# Altium schematic sheet 08_MCU_POWER.SchDoc: MCU POWER
size A4; Author: Gabriel; Organization: Altium Limited; Address1: L3, 12a Rodborough Rd; Address2: Frenchs Forest; Address3: NSW; Address4: Australia 2086; Revision: v2.0; SheetNumber: 8; SheetTotal: 8; Subtitle: XDRONE
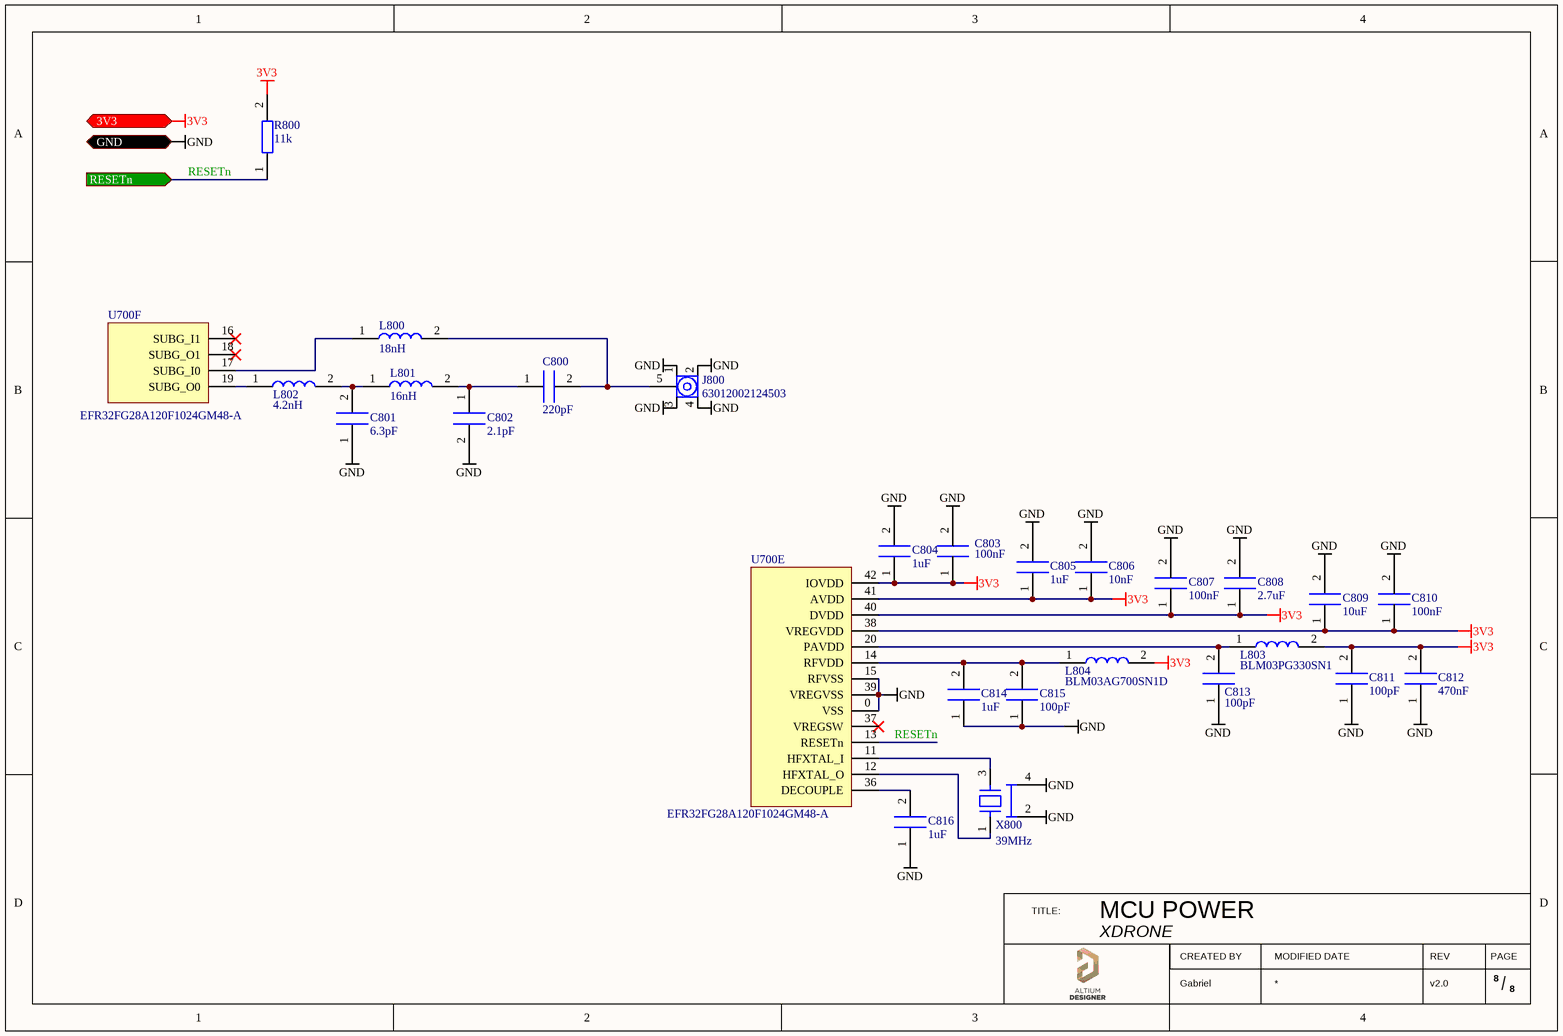
[diagram p0: 08_MCU_POWER.SchDoc]

## Parts
C800  value 220pF  [CAP_0805]  (hidden comment: 220pF_5%_50V_0805_C0G,NP0_QSCT251Q221J1GV001E)
C801  value 6.3pF  [CAP_0402]  (hidden comment: 6.3pF_1.5%_50V_0402_CBR04C639B5GAC)
C802  value 2.1pF  [CAP_0402]  (hidden comment: 2.1pF_5%_50V_0402_GJM1555C1H2R1BB01D)
C803  value 100nF  [CAP_0402]  (hidden comment: 100nF_10%_16V_0402_GRM155R71C104KA88J)
C804  value 1uF  [CAP_0402]  (hidden comment: 1uF_10%_35V_0402_GRM155R6YA105KE11J)
C805  value 1uF  [CAP_0402]  (hidden comment: 1uF_10%_35V_0402_GRM155R6YA105KE11J)
C806  value 10nF  [CAP_0402]  (hidden comment: 10nF_10%_6.3V_0402_CC0402KRX7R5BB103)
C807  value 100nF  [CAP_0402]  (hidden comment: 100nF_10%_16V_0402_GRM155R71C104KA88J)
C808  value 2.7uF  [CAP_0805]  (hidden comment: 2.7uF_10%_10V_0805_X5R_C0805C275K8PAC7800)
C809  value 10uF  [CAP_0402]  (hidden comment: 10uF_20%_6.3V_0402_GRM155R60J106ME05D)
C810  value 100nF  [CAP_0402]  (hidden comment: 100nF_10%_16V_0402_GRM155R71C104KA88J)
C811  value 100pF  [CAP_0402]  (hidden comment: 100pF_5%_50V_0402_CC0402JRNPO9BN101)
C812  value 470nF  [CAP_0402]  (hidden comment: 470nF_10%_6.3V_0402_GRM155C80J474KE19D)
C813  value 100pF  [CAP_0402]  (hidden comment: 100pF_5%_50V_0402_CC0402JRNPO9BN101)
C814  value 1uF  [CAP_0402]  (hidden comment: 1uF_10%_35V_0402_GRM155R6YA105KE11J)
C815  value 100pF  [CAP_0402]  (hidden comment: 100pF_5%_50V_0402_CC0402JRNPO9BN101)
C816  value 1uF  [CAP_0402]  (hidden comment: 1uF_10%_35V_0402_GRM155R6YA105KE11J)
J800  MANUFACTURER REFERENCE: 63012002124503  [RF_63012002124503]  (hidden comment: RF_63012002124503)
L800  value 18nH  [RF_IND_0402]  (hidden comment: 18nH_2%_400mA_LQG15HS18NG02D)
L801  value 16nH  [RF_IND_0402]  (hidden comment: 16nH_3%_400mA_MLG1005S16NHT000)
L802  value 4.2nH  [RF_IND_0402]  (hidden comment: 4.2nH_5%_1.8A_LQW15AN4N2C8ZD)
L803  MANUFACTURER REFERENCE: BLM03PG330SN1  [IND_0201]  (hidden comment: 52nH_25%_750mA_BLM03PG330SN1)
L804  MANUFACTURER REFERENCE: BLM03AG700SN1D  [IND_0201]  (hidden comment: 110nH_50%_200mA_BLM03AG700SN1D)
R800  value 11k  [RES_0402]  (hidden comment: RES_11k_5%_0402_ERJ-2GEJ113X)
U700  MANUFACTURER REFERENCE: EFR32FG28A120F1024GM48-A  [QFN48]  (hidden comment: MCU_1MB_256kB_EFR32FG28A120F1024GM48-A)  (parts E,F of 6)
X800  FREQUENCY: 39MHz  [4-SMD]  (hidden comment: QUARTZ_39MHz_10ppm_ECS-390-10-37B-CKM-TR)

## Ports
3V3 (in), GND (in), RESETn (in)

## Nets
3V3: C803.1 C804.1 C805.1 C806.1 C807.1 C808.1 C809.1 C810.1 C811.2 C812.2 L803.2 L804.2 R800.2 U700.38(VREGVDD) U700.40(DVDD) U700.41(AVDD) U700.42(IOVDD) ; port 3V3
GND: C801.1 C802.2 C803.2 C804.2 C805.2 C806.2 C807.2 C808.2 C809.2 C810.2 C811.1 C812.1 C813.1 C814.1 C815.1 C816.1 J800.1 J800.2 J800.3 J800.4 U700.0(VSS) U700.15(RFVSS) U700.39(VREGVSS) X800.2 X800.4 ; port GND
RESETn: R800.1 U700.13(RESETn) ; port RESETn
NetC800_1: C800.1 C802.1 L801.2
NetC800_2: C800.2 J800.5 L800.2
NetC801_2: C801.2 L801.1 L802.2
NetC813_2: C813.2 L803.1 U700.20(PAVDD)
NetC814_2: C814.2 C815.2 L804.1 U700.14(RFVDD)
NetC816_2: C816.2 U700.36(DECOUPLE)
NetL800_1: L800.1 U700.17(SUBG_I0)
NetL802_1: L802.1 U700.19(SUBG_O0)
NetU700_11: U700.11(HFXTAL_I) X800.3
NetU700_12: U700.12(HFXTAL_O) X800.1

Not connected (* = marked no-connect by the designer): U700 16(SUBG_I1)* 18(SUBG_O1)* 37(VREGSW)*

## Notes on the sheet
- TITLE:
- CREATED BY
- MODIFIED DATE
- REV
- PAGE
- /

## Library data of the parts
C800 = 220pF_5%_50V_0805_C0G,NP0_QSCT251Q221J1GV001E: CAP 220pF 5% 50V 0805 C0G,NP0; MANUFACTURER: JOHANSON TECHLONOGY; DIELECTRIC: C0G, NP0; TOLERANCE: 5%; VOLTAGE RATING: 50V; PACKAGING: 0805; MOUNTING: SMD; MANUFACTURER REFERENCE: QSCT251Q221J1GV001E
C801 = 6.3pF_1.5%_50V_0402_CBR04C639B5GAC: CAPACITOR 6.3pF 1.5% 50V 0402 CBR04C639B5GAC; MANUFACTURER: KEMET; DIELECTRIC: C0G, NP0; TOLERANCE: 1.5%; VOLTAGE RATING: 50V; PACKAGING: 0402; MOUNTING: SMD; MANUFACTURER REFERENCE: CBR04C639B5GAC
C802 = 2.1pF_5%_50V_0402_GJM1555C1H2R1BB01D: CAPACITOR 2.1pF 5% 50V 0402 GJM1555C1H2R1BB01D; MANUFACTURER: MURATA; DIELECTRIC: C0G, NP0; TOLERANCE: 5%; VOLTAGE RATING: 50V; PACKAGING: 0402; MOUNTING: SMD; MANUFACTURER REFERENCE: GJM1555C1H2R1BB01D
C803 C807 C810 = 100nF_10%_16V_0402_GRM155R71C104KA88J: CAPACITOR 100nF 10% X7R 0402; MANUFACTURER: MURATA; VOLTAGE RATING: 16V; DIELECTRIC: X7R; TOLERANCE: 10%; PACKAGING: 0402; MOUNTING: SMD; MANUFACTURER REFERENCE: GRM155R71C104KA88J
C804 C805 C814 C816 = 1uF_10%_35V_0402_GRM155R6YA105KE11J: CAPACITOR 1uF 10% X5R 0402; MANUFACTURER: MURATA; VOLTAGE RATING: 35V; DIELECTRIC: X5R; TOLERANCE: 10%; PACKAGING: 0402; MOUNTING: SMD; MANUFACTURER REFERENCE: GRM155R6YA105KE11J
C806 = 10nF_10%_6.3V_0402_CC0402KRX7R5BB103: CAPACITOR 10nF 10% 6.3V 0402 CC0402KRX7R5BB103; MANUFACTURER: YAGEO; DIELECTRIC: X7R; TOLERANCE: 10%; VOLTAGE RATING: 6.3V; PACKAGING: 0402; MOUNTING: SMD; MANUFACTURER REFERENCE: CC0402KRX7R5BB103
C808 = 2.7uF_10%_10V_0805_X5R_C0805C275K8PAC7800: CAP 2.7uF 10% 10V 0805 X5R C0805C275K8PAC7800; MANUFACTURER: KEMET; DIELECTRIC: X5R; TOLERANCE: 10%; VOLTAGE RATING: 10V; PACKAGING: 0805; MOUNTING: SMD; MANUFACTURER REFERENCE: C0805C275K8PAC7800
C809 = 10uF 20% 6.3V 0402 GRM155R60J106ME05D: CAPACITOR 10uF 20% 6.3V 0402 GRM155R60J106ME05D; MANUFACTURER: MURATA; DIELECTRIC: X5R; TOLERANCE: 20%; VOLTAGE RATING: 6.3V; PACKAGING: 0402; MOUNTING: SMD; MANUFACTURER REFERENCE: GRM155R60J106ME05D
C811 C813 C815 = 100pF_5%_50V_0402_CC0402JRNPO9BN101: CAPACITOR 100pF 5% 50V 0402 CC0402JRNPO9BN101; MANUFACTURER: YAGEO; DIELECTRIC: C0G, NP0; TOLERANCE: 5%; VOLTAGE RATING: 50V; PACKAGING: 0402; MOUNTING: SMD; MANUFACTURER REFERENCE: CC0402JRNPO9BN101
C812 = 470nF_10%_6.3V_0402_GRM155C80J474KE19D: CAPACITOR 470nF 10% 6.3V 0402 GRM155C80J474KE19D; MANUFACTURER: MURATA; DIELECTRIC: X6S; TOLERANCE: 10%; VOLTAGE RATING: 6.3V; PACKAGING: 0402; MOUNTING: SMD; MANUFACTURER REFERENCE: GRM155C80J474KE19D
J800 = RF_63012002124503: RF Connector 63012002124503; MANUFACTURER: WE; PITCH: 2.54 mm; RATED VOLTAGE: 1000V; MOUNTING: THT
L800 = 18nH_2%_400mA_LQG15HS18NG02D: INDUCTOR 18nH 2% 400mA LQG15HS18NG02D; MANUFACTURER: MURATA; TOLERANCE: 2%; PACKAGING: 0402; MOUNTING: SMD; CURRENT RATING: 400mA; MANUFACTURER REFERENCE: LQG15HS18NG02D
L801 = 16nH_3%_400mA_MLG1005S16NHT000: INDUCTOR 16nH 3% 400mA MLG1005S16NHT000; MANUFACTURER: TDK; TOLERANCE: 3%; PACKAGING: 0402; MOUNTING: SMD; CURRENT RATING: 400mA; MANUFACTURER REFERENCE: MLG1005S16NHT000
L802 = 4.2nH_5%_1.8A_LQW15AN4N2C8ZD: INDUCTOR 4.2nH 5% 1.8A LQW15AN4N2C8ZD; MANUFACTURER: MURATA; TOLERANCE: 5%; PACKAGING: 0402; MOUNTING: SMD; CURRENT RATING: 1.8A; MANUFACTURER REFERENCE: LQW15AN4N2C8ZD
L803 = 52nH_25%_750mA_BLM03PG330SN1: INDUCTOR 52uH 25% 750mA BLM03PG330SN1; MANUFACTURER: MURATA; VALUE: 52nF; TOLERANCE: 25%; PACKAGING: 0201; MOUNTING: SMD; CURRENT RATING: 750mA
L804 = 110nH 50% 200mA BLM03AG700SN1D: INDUCTOR 110nH 50% 200mA BLM03AG700SN1D; MANUFACTURER: MURATA; TOLERANCE: 50%; PACKAGING: 0201; MOUNTING: SMD; CURRENT RATING: 200mA; VALUE: 110nH
R800 = RES_11k_5%_0402_ERJ-2GEJ113X: RESISTOR 11k 5% 0402 ERJ-2GEJ113X; MANUFACTURER: PANASONIC; VOLTAGE RATING: 50V; TOLERANCE: 5%; MOUNTING: SMD; MANUFACTURER REFERENCE: ERJ-2GEJ113X; PACKAGING: 0402
U700 = MCU_1MB_256kB_EFR32FG28A120F1024GM48-A: MCU 1MB 256kB EFR32FG28A120F1024GM48-A; MANUFACTURER: SILICON LABS; PACKAGING: QFN48 0606; FLASH SIZE: 1 MB; RAM SIZE: 256 KB; PIN COUNT: 48; MOUNTING: SMD
X800 = QUARTZ_39MHz_10ppm_ECS-390-10-37B-CKM-TR: QUARTZ 39MHz 10ppm ECS-390-10-37B-CKM-TR; MANUFACTURER: ECS; MANUFACTURER REFERENCE: ECS-390-10-37B-CKM-TR; MOUNTING: SMD; PACKAGING: 4-SMD; TOLERANCE: 10 ppm; STABILITY: 10 ppm